# Altium schematic sheet Integrated MCU.SchDoc: Integrated MCU
size A4; DrawnBy: Alvin Ha; DocumentNumber: BMS2018-02; Revision: 2.0
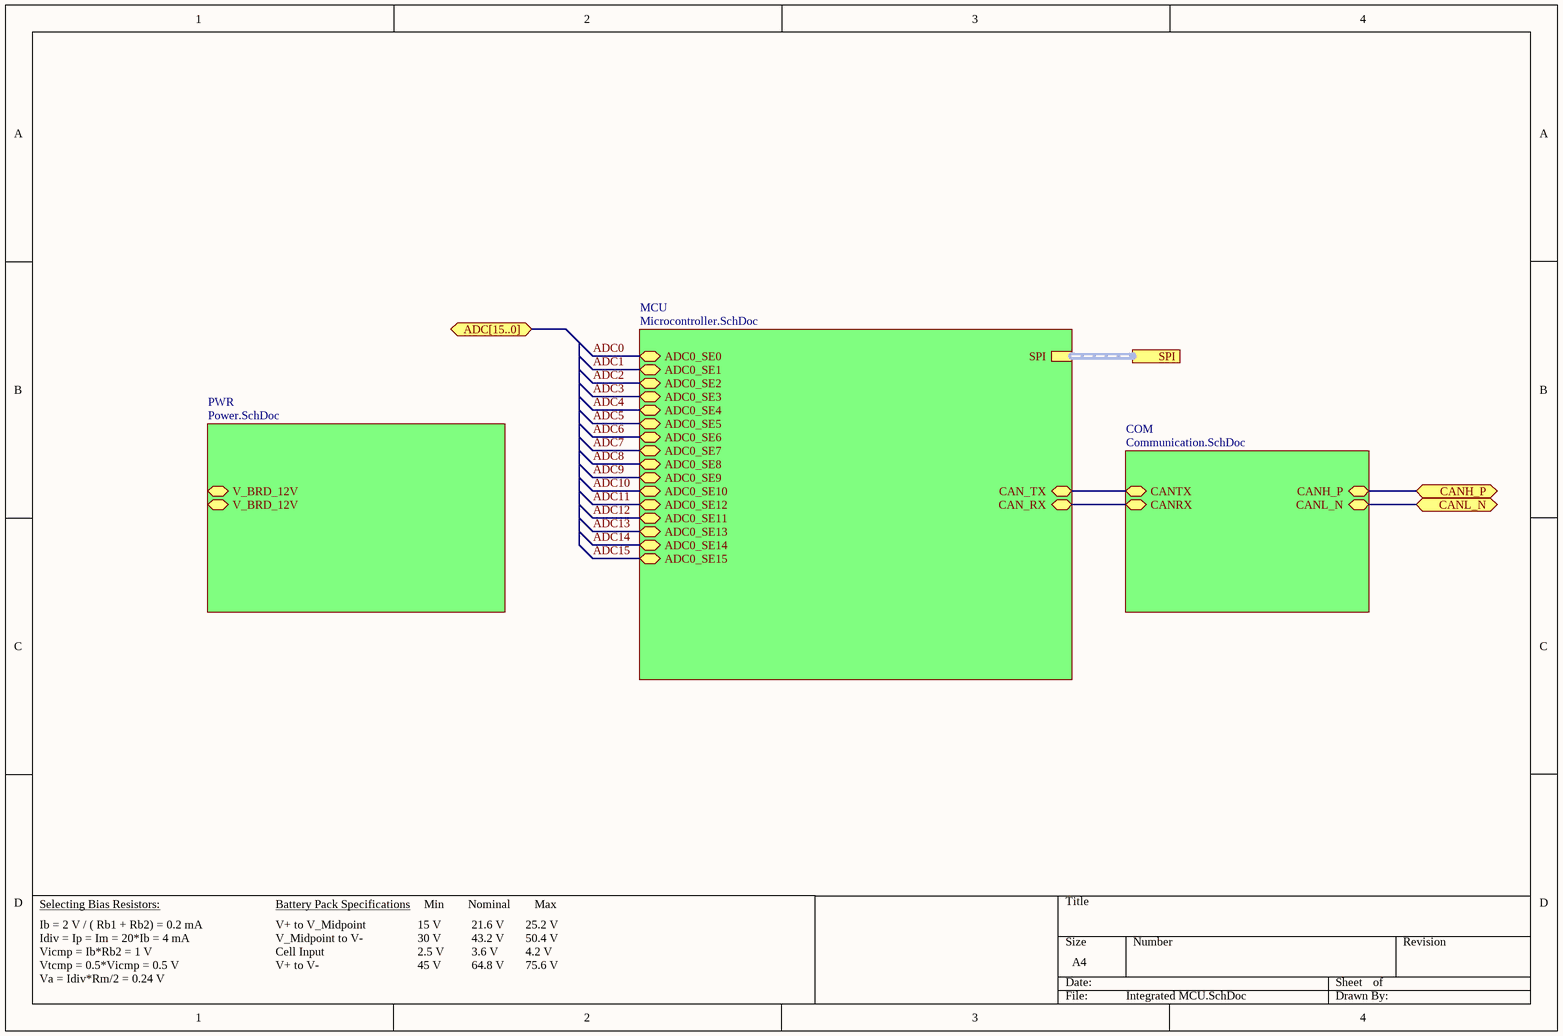
[diagram p0: Integrated MCU.SchDoc]

## Sub-sheets
COM = Communication.SchDoc: CANH_P (bidir), CANL_N (bidir), CANRX (bidir), CANTX (bidir)
MCU = Microcontroller.SchDoc: ADC0_SE3 (bidir), ADC0_SE6 (bidir), ADC0_SE4 (bidir), ADC0_SE1 (bidir), ADC0_SE13 (bidir), ADC0_SE7 (bidir), ADC0_SE5 (bidir), ADC0_SE14 (bidir), ADC0_SE12 (bidir), SPI (harness SPI), ADC0_SE2 (bidir), ADC0_SE0 (bidir), ADC0_SE11 (bidir), ADC0_SE15 (bidir), ADC0_SE8 (bidir), ADC0_SE10 (bidir), ADC0_SE9 (bidir), CAN_RX (bidir), CAN_TX (bidir)
PWR = Power.SchDoc: V_BRD_12V (bidir), V_BRD_12V (bidir)

## Ports
ADC[15..0] (bidir), CANH_P (bidir), CANL_N (bidir), SPI

## Nets
ADC0: sheet MCU/ADC0_SE0
ADC1: sheet MCU/ADC0_SE1
ADC2: sheet MCU/ADC0_SE2
ADC3: sheet MCU/ADC0_SE3
ADC4: sheet MCU/ADC0_SE4
ADC5: sheet MCU/ADC0_SE5
ADC6: sheet MCU/ADC0_SE6
ADC7: sheet MCU/ADC0_SE7
ADC8: sheet MCU/ADC0_SE8
ADC9: sheet MCU/ADC0_SE9
ADC10: sheet MCU/ADC0_SE10
ADC11: sheet MCU/ADC0_SE12
ADC12: sheet MCU/ADC0_SE11
ADC13: sheet MCU/ADC0_SE13
ADC14: sheet MCU/ADC0_SE14
ADC15: sheet MCU/ADC0_SE15
CANH_P: port CANH_P, sheet COM/CANH_P
CANL_N: port CANL_N, sheet COM/CANL_N
(unnamed): sheet MCU/CAN_RX, sheet COM/CANRX
(unnamed): sheet MCU/CAN_TX, sheet COM/CANTX

## Buses and harness runs
harness port SPI = sheet MCU/SPI

## Notes on the sheet
- Selecting Bias Resistors:
- Battery Pack Specifications
- Min        Nominal        Max
- Ib = 2 V / ( Rb1 + Rb2) = 0.2 mA
  Idiv = Ip = Im = 20*Ib = 4 mA
  Vicmp = Ib*Rb2 = 1 V
  Vtcmp = 0.5*Vicmp = 0.5 V
  Va = Idiv*Rm/2 = 0.24 V
- 15 V
  30 V
  2.5 V
  45 V
- 21.6 V
  43.2 V
  3.6 V
  64.8 V
- 25.2 V
  50.4 V
  4.2 V
  75.6 V
- V+ to V_Midpoint
  V_Midpoint to V-
  Cell Input
  V+ to V-